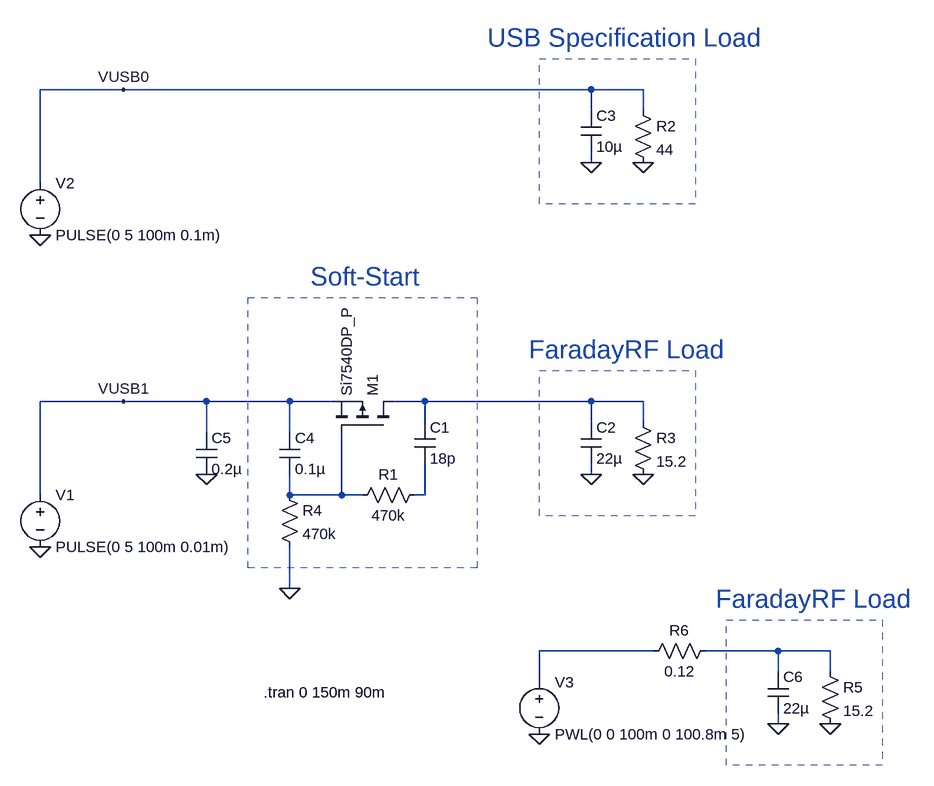
[diagram p0: schematic USB_Soft-Start.asc]
USB_Soft-Start.asc, the LTspice schematic file:
Version 4
SHEET 1 1396 692
WIRE 128 -352 0 -352
WIRE 848 -352 128 -352
WIRE 928 -352 848 -352
WIRE 848 -320 848 -352
WIRE 928 -320 928 -352
WIRE 848 -240 848 -256
WIRE 0 -208 0 -352
WIRE 128 128 0 128
WIRE 256 128 128 128
WIRE 384 128 256 128
WIRE 448 128 384 128
WIRE 592 128 544 128
WIRE 848 128 592 128
WIRE 928 128 848 128
WIRE 592 160 592 128
WIRE 848 160 848 128
WIRE 928 160 928 128
WIRE 256 176 256 128
WIRE 384 176 384 128
WIRE 848 240 848 224
WIRE 0 272 0 128
WIRE 384 272 384 240
WIRE 464 272 464 176
WIRE 464 272 384 272
WIRE 496 272 464 272
WIRE 592 272 592 224
WIRE 592 272 576 272
WIRE 384 416 384 352
WIRE 944 512 768 512
WIRE 1136 512 1024 512
WIRE 1216 512 1136 512
WIRE 1136 544 1136 512
WIRE 1216 544 1216 512
WIRE 768 560 768 512
WIRE 1136 624 1136 608
FLAG 0 352 0
FLAG 928 240 0
FLAG 848 240 0
FLAG 928 -240 0
FLAG 848 -240 0
FLAG 128 128 VUSB1
FLAG 0 -128 0
FLAG 128 -352 VUSB0
FLAG 256 240 0
FLAG 384 416 0
FLAG 1216 624 0
FLAG 1136 624 0
FLAG 768 640 0
SYMBOL voltage 0 256 R0
WINDOW 123 0 0 Left 2
WINDOW 39 0 0 Left 2
SYMATTR InstName V1
SYMATTR Value PULSE(0 5 100m 0.01m)
SYMBOL cap 576 160 R0
SYMATTR InstName C1
SYMATTR Value 18p
SYMATTR SpiceLine Rser=10m
SYMBOL pmos 544 176 M270
SYMATTR InstName M1
SYMATTR Value Si7540DP_P
SYMBOL res 912 144 R0
SYMATTR InstName R3
SYMATTR Value 15.2
SYMBOL cap 832 160 R0
SYMATTR InstName C2
SYMATTR Value 22µ
SYMATTR SpiceLine Rser=10m
SYMBOL res 912 -336 R0
SYMATTR InstName R2
SYMATTR Value 44
SYMBOL cap 832 -320 R0
SYMATTR InstName C3
SYMATTR Value 10µ
SYMATTR SpiceLine Rser=10m
SYMBOL res 368 256 R0
SYMATTR InstName R4
SYMATTR Value 470k
SYMBOL res 592 256 R90
WINDOW 0 0 56 VBottom 2
WINDOW 3 32 56 VTop 2
SYMATTR InstName R1
SYMATTR Value 470k
SYMBOL cap 368 176 R0
SYMATTR InstName C4
SYMATTR Value 0.1µ
SYMATTR SpiceLine Rser=10m
SYMBOL voltage 0 -224 R0
WINDOW 123 0 0 Left 2
WINDOW 39 0 0 Left 2
SYMATTR InstName V2
SYMATTR Value PULSE(0 5 100m 0.1m)
SYMBOL cap 240 176 R0
SYMATTR InstName C5
SYMATTR Value 0.2µ
SYMATTR SpiceLine Rser=10m
SYMBOL res 1200 528 R0
SYMATTR InstName R5
SYMATTR Value 15.2
SYMBOL cap 1120 544 R0
SYMATTR InstName C6
SYMATTR Value 22µ
SYMATTR SpiceLine Rser=10m
SYMBOL voltage 768 544 R0
WINDOW 123 0 0 Left 2
WINDOW 39 0 0 Left 2
SYMATTR InstName V3
SYMATTR Value PWL(0 0 100m 0 100.8m 5)
SYMBOL res 928 528 R270
WINDOW 0 32 56 VTop 2
WINDOW 3 0 56 VBottom 2
SYMATTR InstName R6
SYMATTR Value 0.12
TEXT 344 576 Left 2 !.tran 0 150m 90m
TEXT 416 -64 Left 4 ;Soft-Start
TEXT 752 48 Left 4 ;FaradayRF Load
TEXT 688 -432 Left 4 ;USB Specification Load
TEXT 1040 432 Left 4 ;FaradayRF Load
RECTANGLE Normal 1008 304 768 80 2
RECTANGLE Normal 1008 -176 768 -400 2
RECTANGLE Normal 672 384 320 -32 2
RECTANGLE Normal 1296 688 1056 464 2

The netlist it stands for:
* USB_Soft-Start.asc
V1 VUSB1 0 PULSE(0 5 100m 0.01m)
C1 N001 N003 18p Rser=10m
M1 N001 N002 VUSB1 VUSB1 Si7540DP_P
R3 N001 0 15.2
C2 N001 0 22µ Rser=10m
R2 VUSB0 0 44
C3 VUSB0 0 10µ Rser=10m
R4 N002 0 470k
R1 N003 N002 470k
C4 VUSB1 N002 0.1µ Rser=10m
V2 VUSB0 0 PULSE(0 5 100m 0.1m)
C5 VUSB1 0 0.2µ Rser=10m
R5 N005 0 15.2
C6 N005 0 22µ Rser=10m
V3 N004 0 PWL(0 0 100m 0 100.8m 5)
R6 N004 N005 0.12
.model NMOS NMOS
.model PMOS PMOS
.lib standard.mos
.tran 0 150m 90m
* Soft-Start
* FaradayRF Load
* USB Specification Load
* FaradayRF Load
.backanno
.end